# Altium project SNESDRONE_Direct_IO.PrjPcb
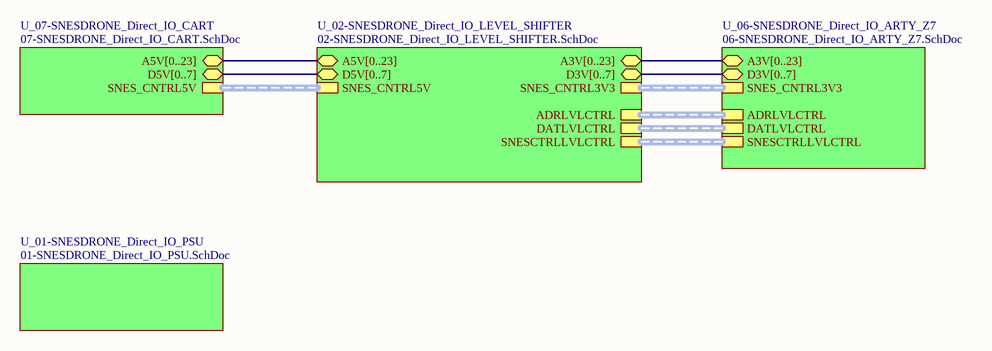
[diagram p0: 00-SNESDRONE_Direct_IO_MAIN.SchDoc]
8 sheets, 28 parts. Net scope: hierarchical (ports join the sheet entries above them; power ports are global).
Board file: SNESDRONE_Direct_IO.PcbDoc
Sheets:
  00-SNESDRONE_Direct_IO_MAIN.SchDoc
    U_01-SNESDRONE_Direct_IO_PSU = 01-SNESDRONE_Direct_IO_PSU.SchDoc
    U_02-SNESDRONE_Direct_IO_LEVEL_SHIFTER = 02-SNESDRONE_Direct_IO_LEVEL_SHIFTER.SchDoc
      U_03-SNESDRONE_Direct_IO_LEVEL_SHIFTER_0 = 03-SNESDRONE_Direct_IO_LEVEL_SHIFTER_0.SchDoc
      U_04-SNESDRONE_Direct_IO_LEVEL_SHIFTER_1 = 04-SNESDRONE_Direct_IO_LEVEL_SHIFTER_1.SchDoc
      U_05-SNESDRONE_Direct_IO_LEVEL_SHIFTER_2 = 05-SNESDRONE_Direct_IO_LEVEL_SHIFTER_2.SchDoc
    U_06-SNESDRONE_Direct_IO_ARTY_Z7 = 06-SNESDRONE_Direct_IO_ARTY_Z7.SchDoc
    U_07-SNESDRONE_Direct_IO_CART = 07-SNESDRONE_Direct_IO_CART.SchDoc

## Sheet 00-SNESDRONE_Direct_IO_MAIN.SchDoc
size A4

### Sub-sheets
U_01-SNESDRONE_Direct_IO_PSU = 01-SNESDRONE_Direct_IO_PSU.SchDoc: no entries
U_02-SNESDRONE_Direct_IO_LEVEL_SHIFTER = 02-SNESDRONE_Direct_IO_LEVEL_SHIFTER.SchDoc: A5V[0..23] (bidir), A3V[0..23] (bidir), D5V[0..7] (bidir), D3V[0..7] (bidir), ADRLVLCTRL (harness ADRLVLCTRL), DATLVLCTRL (harness DATLVLCTRL), SNES_CNTRL5V (harness SNES_CNTRL5V), SNES_CNTRL3V3 (harness SNES_CNTRL3V3), SNESCTRLLVLCTRL (harness SNESCTRLLVLCTRL)
U_06-SNESDRONE_Direct_IO_ARTY_Z7 = 06-SNESDRONE_Direct_IO_ARTY_Z7.SchDoc: A3V[0..23] (bidir), D3V[0..7] (bidir), ADRLVLCTRL (harness ADRLVLCTRL), DATLVLCTRL (harness DATLVLCTRL), SNES_CNTRL3V3 (harness SNES_CNTRL3V3), SNESCTRLLVLCTRL (harness SNESCTRLLVLCTRL)
U_07-SNESDRONE_Direct_IO_CART = 07-SNESDRONE_Direct_IO_CART.SchDoc: A5V[0..23] (bidir), D5V[0..7] (bidir), SNES_CNTRL5V (harness SNES_CNTRL5V)

### Buses and harness runs
bus sheet U_02-SNESDRONE_Direct_IO_LEVEL_SHIFTER/A3V[0..23] = sheet U_06-SNESDRONE_Direct_IO_ARTY_Z7/A3V[0..23]
bus sheet U_02-SNESDRONE_Direct_IO_LEVEL_SHIFTER/A5V[0..23] = sheet U_07-SNESDRONE_Direct_IO_CART/A5V[0..23]
bus sheet U_02-SNESDRONE_Direct_IO_LEVEL_SHIFTER/D3V[0..7] = sheet U_06-SNESDRONE_Direct_IO_ARTY_Z7/D3V[0..7]
bus sheet U_02-SNESDRONE_Direct_IO_LEVEL_SHIFTER/D5V[0..7] = sheet U_07-SNESDRONE_Direct_IO_CART/D5V[0..7]
harness sheet U_02-SNESDRONE_Direct_IO_LEVEL_SHIFTER/ADRLVLCTRL = sheet U_06-SNESDRONE_Direct_IO_ARTY_Z7/ADRLVLCTRL
harness sheet U_02-SNESDRONE_Direct_IO_LEVEL_SHIFTER/DATLVLCTRL = sheet U_06-SNESDRONE_Direct_IO_ARTY_Z7/DATLVLCTRL
harness sheet U_02-SNESDRONE_Direct_IO_LEVEL_SHIFTER/SNES_CNTRL3V3 = sheet U_06-SNESDRONE_Direct_IO_ARTY_Z7/SNES_CNTRL3V3
harness sheet U_02-SNESDRONE_Direct_IO_LEVEL_SHIFTER/SNES_CNTRL5V = sheet U_07-SNESDRONE_Direct_IO_CART/SNES_CNTRL5V
harness sheet U_02-SNESDRONE_Direct_IO_LEVEL_SHIFTER/SNESCTRLLVLCTRL = sheet U_06-SNESDRONE_Direct_IO_ARTY_Z7/SNESCTRLLVLCTRL

## Sheet 01-SNESDRONE_Direct_IO_PSU.SchDoc
size A4
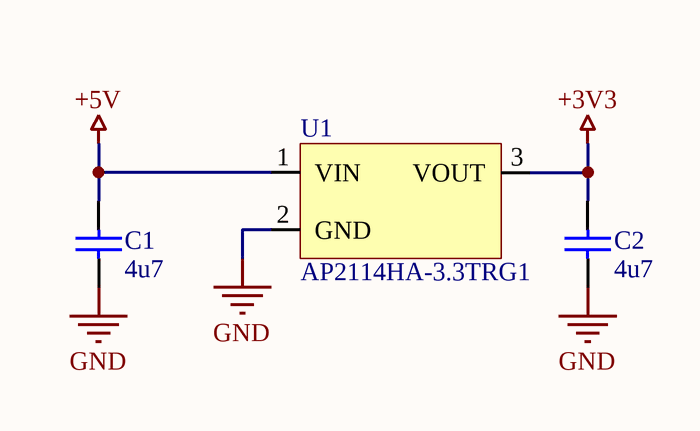
[diagram p1: 01-SNESDRONE_Direct_IO_PSU.SchDoc]

### Parts
C1  value 4u7  [cap_0603]  (hidden comment: cap_0603)
C2  value 4u7  [cap_0603]  (hidden comment: cap_0603)
U1  AP2114HA-3.3TRG1  [SOT223]

### Nets
+3V3: C2.2 U1.3(VOUT)
+5V: C1.2 U1.1(VIN)
GND: C1.1 C2.1 U1.2(GND)

### Library data of the parts
C1 C2 = cap_0603: Capacitor
U1 = AP2114HA-3.3TRG1: PMIC - Spannungsregler - Linear Positiv Fest 1 Ausgang 1A SOT-223-3

## Sheet 02-SNESDRONE_Direct_IO_LEVEL_SHIFTER.SchDoc
size A4
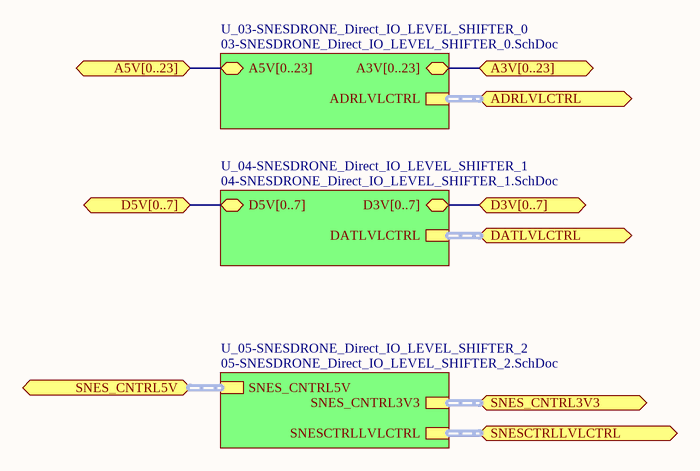
[diagram p2: 02-SNESDRONE_Direct_IO_LEVEL_SHIFTER.SchDoc]

### Sub-sheets
U_03-SNESDRONE_Direct_IO_LEVEL_SHIFTER_0 = 03-SNESDRONE_Direct_IO_LEVEL_SHIFTER_0.SchDoc: A5V[0..23] (bidir), A3V[0..23] (bidir), ADRLVLCTRL (harness ADRLVLCTRL)
U_04-SNESDRONE_Direct_IO_LEVEL_SHIFTER_1 = 04-SNESDRONE_Direct_IO_LEVEL_SHIFTER_1.SchDoc: D5V[0..7] (bidir), D3V[0..7] (bidir), DATLVLCTRL (harness DATLVLCTRL)
U_05-SNESDRONE_Direct_IO_LEVEL_SHIFTER_2 = 05-SNESDRONE_Direct_IO_LEVEL_SHIFTER_2.SchDoc: SNES_CNTRL5V (harness SNES_CNTRL5V), SNES_CNTRL3V3 (harness SNES_CNTRL3V3), SNESCTRLLVLCTRL (harness SNESCTRLLVLCTRL)

### Ports
A3V[0..23] (bidir), A5V[0..23] (bidir), ADRLVLCTRL (bidir, harness ADRLVLCTRL), D3V[0..7] (bidir), D5V[0..7] (bidir), DATLVLCTRL (bidir, harness DATLVLCTRL), SNES_CNTRL3V3 (bidir, harness SNES_CNTRL3V3), SNES_CNTRL5V (bidir, harness SNES_CNTRL5V), SNESCTRLLVLCTRL (bidir, harness SNESCTRLLVLCTRL)

### Buses and harness runs
bus port A3V[0..23] = sheet U_03-SNESDRONE_Direct_IO_LEVEL_SHIFTER_0/A3V[0..23]
bus port A5V[0..23] = sheet U_03-SNESDRONE_Direct_IO_LEVEL_SHIFTER_0/A5V[0..23]
bus port D3V[0..7] = sheet U_04-SNESDRONE_Direct_IO_LEVEL_SHIFTER_1/D3V[0..7]
bus port D5V[0..7] = sheet U_04-SNESDRONE_Direct_IO_LEVEL_SHIFTER_1/D5V[0..7]
harness port ADRLVLCTRL = sheet U_03-SNESDRONE_Direct_IO_LEVEL_SHIFTER_0/ADRLVLCTRL
harness port DATLVLCTRL = sheet U_04-SNESDRONE_Direct_IO_LEVEL_SHIFTER_1/DATLVLCTRL
harness port SNES_CNTRL3V3 = sheet U_05-SNESDRONE_Direct_IO_LEVEL_SHIFTER_2/SNES_CNTRL3V3
harness port SNES_CNTRL5V = sheet U_05-SNESDRONE_Direct_IO_LEVEL_SHIFTER_2/SNES_CNTRL5V
harness port SNESCTRLLVLCTRL = sheet U_05-SNESDRONE_Direct_IO_LEVEL_SHIFTER_2/SNESCTRLLVLCTRL

## Sheet 03-SNESDRONE_Direct_IO_LEVEL_SHIFTER_0.SchDoc
size A4
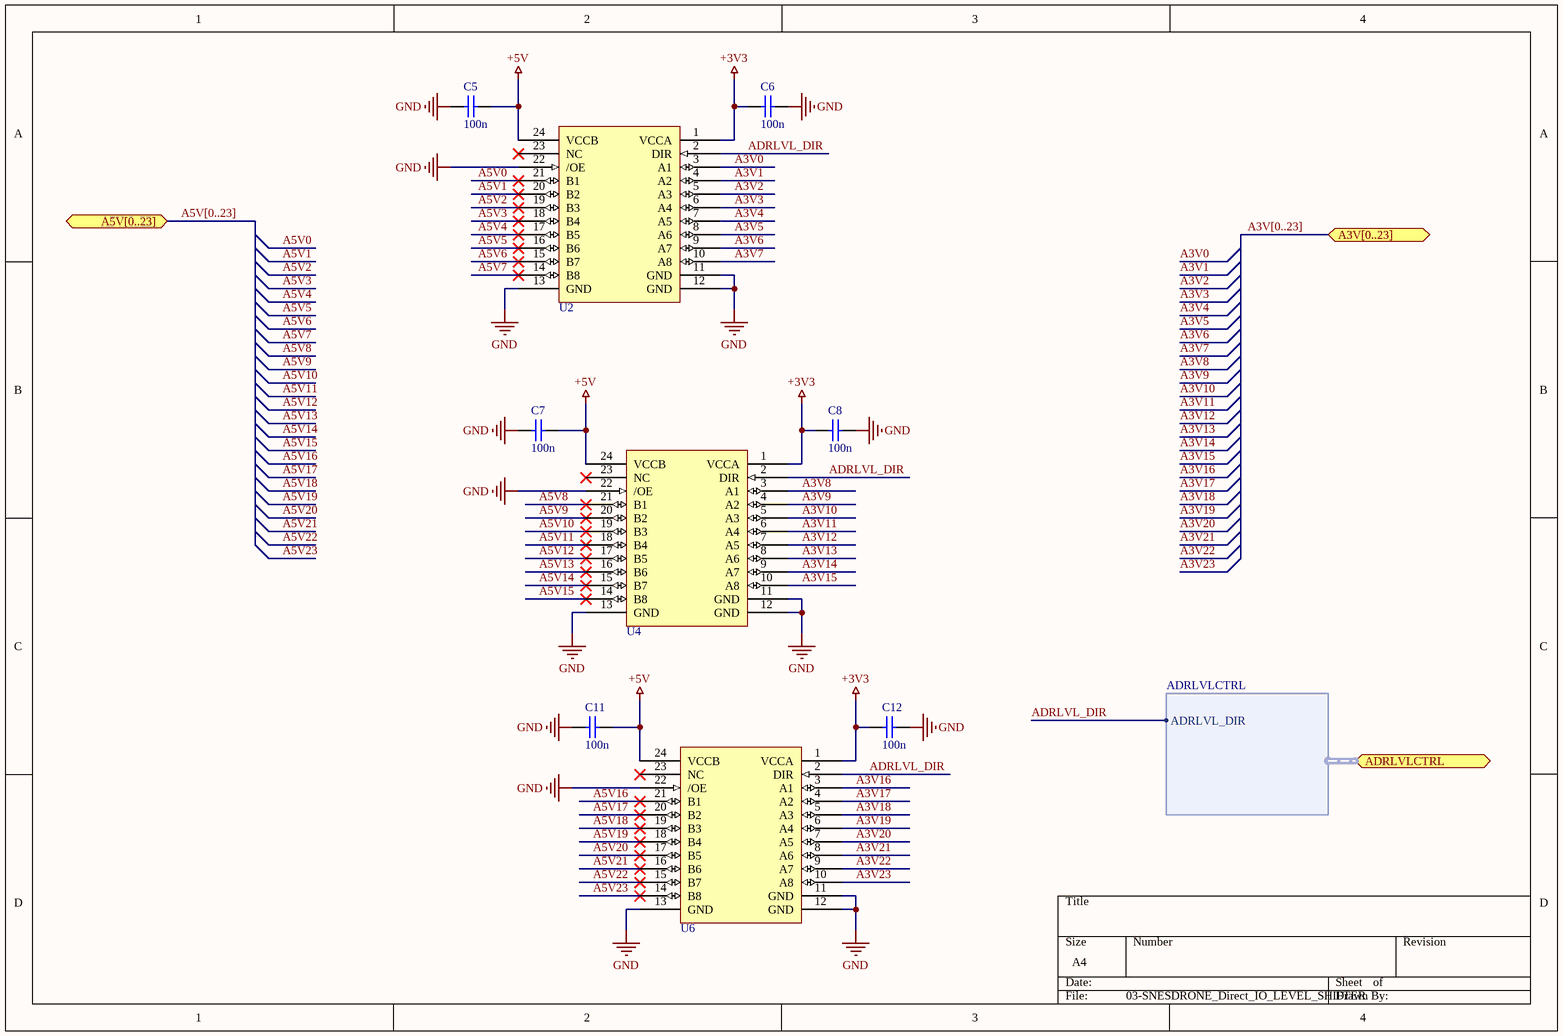
[diagram p3: 03-SNESDRONE_Direct_IO_LEVEL_SHIFTER_0.SchDoc]

### Parts
C5  value 100n  [cap_0603]  (hidden comment: cap_0603)
C6  value 100n  [cap_0603]  (hidden comment: cap_0603)
C7  value 100n  [cap_0603]  (hidden comment: cap_0603)
C8  value 100n  [cap_0603]  (hidden comment: cap_0603)
C11  value 100n  [cap_0603]  (hidden comment: cap_0603)
C12  value 100n  [cap_0603]  (hidden comment: cap_0603)
U2  IC_SN74LVCC3245APWR  [TSSOP24]  (value not drawn)
U4  IC_SN74LVCC3245APWR  [TSSOP24]  (value not drawn)
U6  IC_SN74LVCC3245APWR  [TSSOP24]  (value not drawn)

### Ports
A3V[0..23] (bidir), A5V[0..23] (bidir), ADRLVLCTRL (bidir, harness ADRLVLCTRL)

### Harnesses
ADRLVLCTRL: ADRLVL_DIR

### Nets
+3V3: C6.2 C8.2 C12.2 U2.1(VCCA) U4.1(VCCA) U6.1(VCCA)
+5V: C5.1 C7.1 C11.1 U2.24(VCCB) U4.24(VCCB) U6.24(VCCB)
GND: C5.2 C6.1 C7.2 C8.1 C11.2 C12.1 U2.11(GND) U2.12(GND) U2.13(GND) U2.22(/OE) U4.11(GND) U4.12(GND) U4.13(GND) U4.22(/OE) U6.11(GND) U6.12(GND) U6.13(GND) U6.22(/OE)
A3V0: U2.3(A1)
A3V1: U2.4(A2)
A3V2: U2.5(A3)
A3V3: U2.6(A4)
A3V4: U2.7(A5)
A3V5: U2.8(A6)
A3V6: U2.9(A7)
A3V7: U2.10(A8)
A3V8: U4.3(A1)
A3V9: U4.4(A2)
A3V10: U4.5(A3)
A3V11: U4.6(A4)
A3V12: U4.7(A5)
A3V13: U4.8(A6)
A3V14: U4.9(A7)
A3V15: U4.10(A8)
A3V16: U6.3(A1)
A3V17: U6.4(A2)
A3V18: U6.5(A3)
A3V19: U6.6(A4)
A3V20: U6.7(A5)
A3V21: U6.8(A6)
A3V22: U6.9(A7)
A3V23: U6.10(A8)
A5V0: U2.21(B1)
A5V1: U2.20(B2)
A5V2: U2.19(B3)
A5V3: U2.18(B4)
A5V4: U2.17(B5)
A5V5: U2.16(B6)
A5V6: U2.15(B7)
A5V7: U2.14(B8)
A5V8: U4.21(B1)
A5V9: U4.20(B2)
A5V10: U4.19(B3)
A5V11: U4.18(B4)
A5V12: U4.17(B5)
A5V13: U4.16(B6)
A5V14: U4.15(B7)
A5V15: U4.14(B8)
A5V16: U6.21(B1)
A5V17: U6.20(B2)
A5V18: U6.19(B3)
A5V19: U6.18(B4)
A5V20: U6.17(B5)
A5V21: U6.16(B6)
A5V22: U6.15(B7)
A5V23: U6.14(B8)
ADRLVL_DIR: U2.2(DIR) U4.2(DIR) U6.2(DIR) ; port ADRLVLCTRL.ADRLVL_DIR

Not connected (* = marked no-connect by the designer): U2 23(NC)*; U4 23(NC)*; U6 23(NC)*

### Buses and harness runs
bus A3V[0..23] = port A3V[0..23]
bus A5V[0..23] = port A5V[0..23]

### Library data of the parts
C5-C8 C11 C12 = cap_0603: Capacitor
U2 U4 U6 = IC_SN74LVCC3245APWR: Bus-Transceiver, Produktreihe LVC, 8 Eingänge, 50mA, 7ns, 2.3V bis 5.5V, TSSOP 24; Manufacturer 1: TEXAS INSTRUMENTS; ComponentLink3Description: datsheet; ComponentLink3URL: http://www.ti.com/lit/ds/symlink/sn74lvcc3245a.pdf; ComponentLink4Description: farnell; ComponentLink4URL: https://at.farnell.com/texas-instruments/sn74lvcc3245apwr/bus-transceiver-8bit-tssop-24/dp/2854646?rpsku=rel3%3A2119962&st=2119962; Supplier 1: Farnell; Supplier Part Number 1: 2854646; Manufacturer Part Number 1: SN74LVCC3245APWR; Supplier Unit Price 1: 0,99; Supplier Order Qty 1: 1

## Sheet 04-SNESDRONE_Direct_IO_LEVEL_SHIFTER_1.SchDoc
size A4
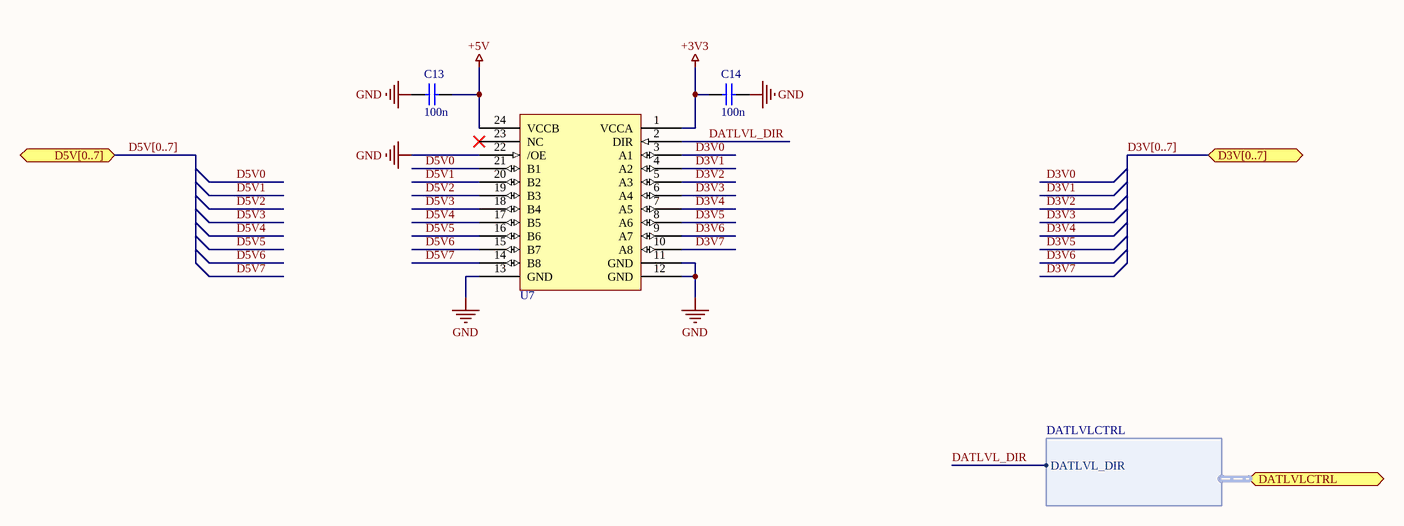
[diagram p4: 04-SNESDRONE_Direct_IO_LEVEL_SHIFTER_1.SchDoc]

### Parts
C13  value 100n  [cap_0603]  (hidden comment: cap_0603)
C14  value 100n  [cap_0603]  (hidden comment: cap_0603)
U7  IC_SN74LVCC3245APWR  [TSSOP24]  (value not drawn)

### Ports
D3V[0..7] (bidir), D5V[0..7] (bidir), DATLVLCTRL (bidir, harness DATLVLCTRL)

### Harnesses
DATLVLCTRL: DATLVL_DIR

### Nets
+3V3: C14.2 U7.1(VCCA)
+5V: C13.1 U7.24(VCCB)
GND: C13.2 C14.1 U7.11(GND) U7.12(GND) U7.13(GND) U7.22(/OE)
D3V0: U7.3(A1)
D3V1: U7.4(A2)
D3V2: U7.5(A3)
D3V3: U7.6(A4)
D3V4: U7.7(A5)
D3V5: U7.8(A6)
D3V6: U7.9(A7)
D3V7: U7.10(A8)
D5V0: U7.21(B1)
D5V1: U7.20(B2)
D5V2: U7.19(B3)
D5V3: U7.18(B4)
D5V4: U7.17(B5)
D5V5: U7.16(B6)
D5V6: U7.15(B7)
D5V7: U7.14(B8)
DATLVL_DIR: U7.2(DIR) ; port DATLVLCTRL.DATLVL_DIR

Not connected (* = marked no-connect by the designer): U7 23(NC)*

### Buses and harness runs
bus D3V[0..7] = port D3V[0..7]
bus D5V[0..7] = port D5V[0..7]

### Library data of the parts
C13 C14 = cap_0603: Capacitor
U7 = IC_SN74LVCC3245APWR: as U2 on sheet 03-SNESDRONE_Direct_IO_LEVEL_SHIFTER_0; ComponentLink3Description: datsheet; ComponentLink3URL: http://www.ti.com/lit/ds/symlink/sn74lvcc3245a.pdf; ComponentLink4Description: farnell; ComponentLink4URL: https://at.farnell.com/texas-instruments/sn74lvcc3245apwr/bus-transceiver-8bit-tssop-24/dp/2854646?rpsku=rel3%3A2119962&st=2119962; Supplier 1: Farnell; Supplier Part Number 1: 2854646; Manufacturer Part Number 1: SN74LVCC3245APWR; Supplier Unit Price 1: 0,99; Supplier Order Qty 1: 1

## Sheet 05-SNESDRONE_Direct_IO_LEVEL_SHIFTER_2.SchDoc
size A4
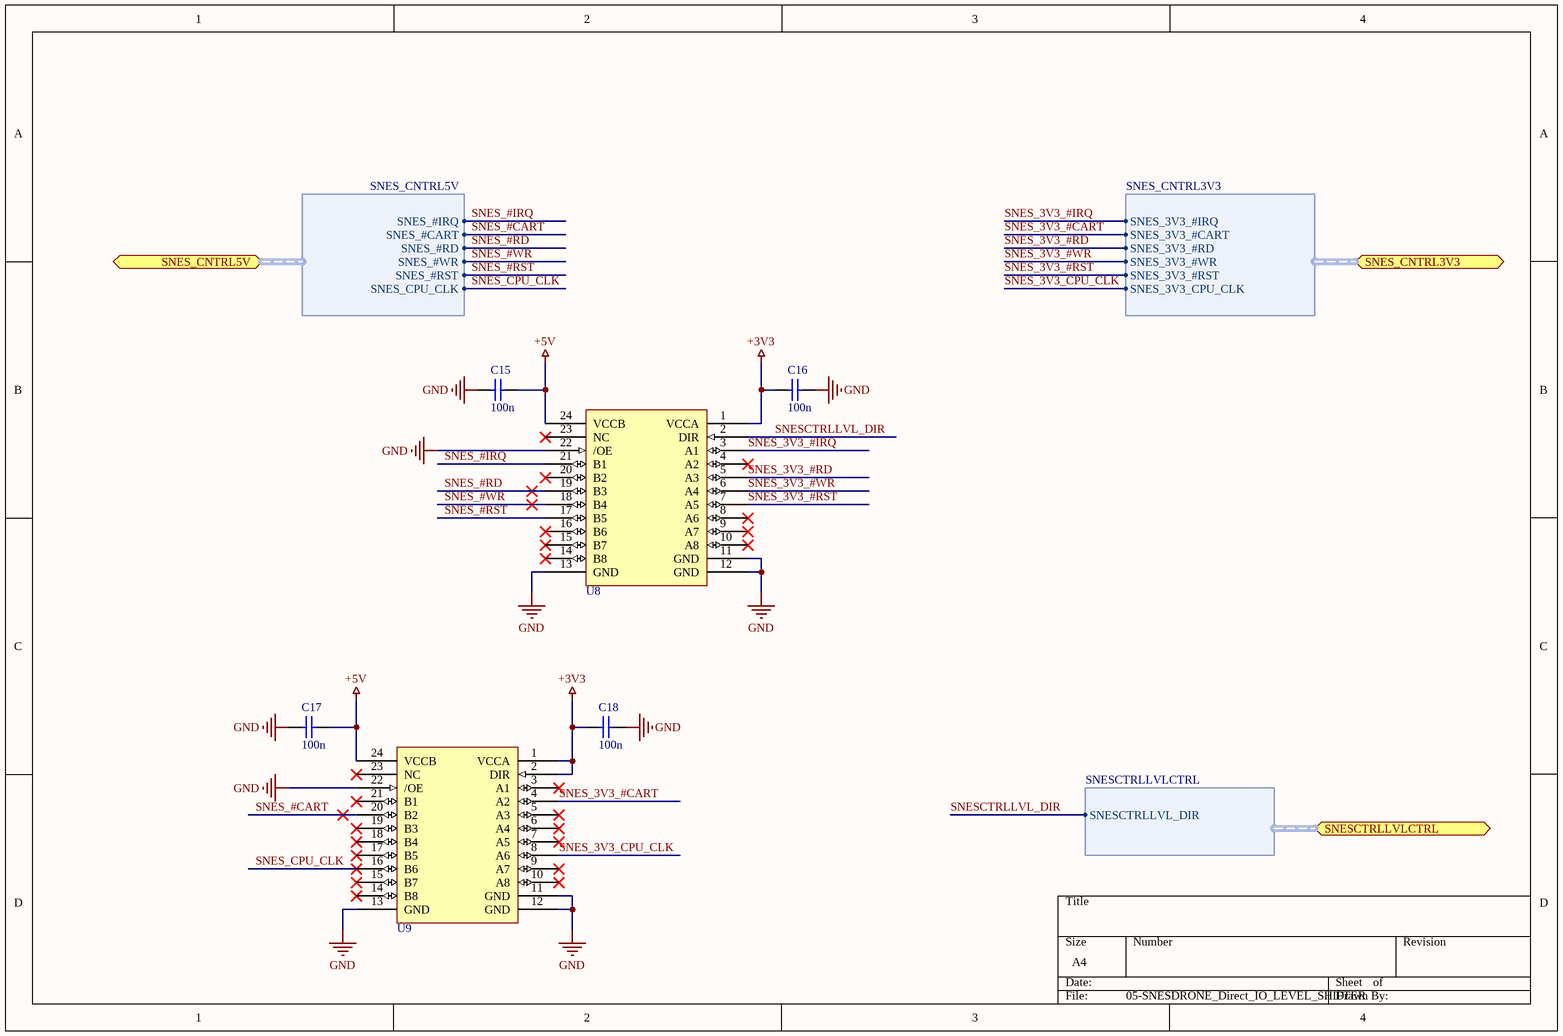
[diagram p5: 05-SNESDRONE_Direct_IO_LEVEL_SHIFTER_2.SchDoc]

### Parts
C15  value 100n  [cap_0603]  (hidden comment: cap_0603)
C16  value 100n  [cap_0603]  (hidden comment: cap_0603)
C17  value 100n  [cap_0603]  (hidden comment: cap_0603)
C18  value 100n  [cap_0603]  (hidden comment: cap_0603)
U8  IC_SN74LVCC3245APWR  [TSSOP24]  (value not drawn)
U9  IC_SN74LVCC3245APWR  [TSSOP24]  (value not drawn)

### Ports
SNES_CNTRL3V3 (bidir, harness SNES_CNTRL3V3), SNES_CNTRL5V (bidir, harness SNES_CNTRL5V), SNESCTRLLVLCTRL (bidir, harness SNESCTRLLVLCTRL)

### Harnesses
SNES_CNTRL5V: SNES_#IRQ, SNES_#CART, SNES_#RD, SNES_#WR, SNES_#RST, SNES_CPU_CLK
SNES_CNTRL3V3: SNES_3V3_#IRQ, SNES_3V3_#CART, SNES_3V3_#RD, SNES_3V3_#WR, SNES_3V3_#RST, SNES_3V3_CPU_CLK
SNESCTRLLVLCTRL: SNESCTRLLVL_DIR

### Nets
+3V3: C16.2 C18.2 U8.1(VCCA) U9.1(VCCA) U9.2(DIR)
+5V: C15.1 C17.1 U8.24(VCCB) U9.24(VCCB)
GND: C15.2 C16.1 C17.2 C18.1 U8.11(GND) U8.12(GND) U8.13(GND) U8.22(/OE) U9.11(GND) U9.12(GND) U9.13(GND) U9.22(/OE)
SNES_3V3_#CART: U9.4(A2) ; port SNES_CNTRL3V3.SNES_3V3_#CART
SNES_3V3_#IRQ: U8.3(A1) ; port SNES_CNTRL3V3.SNES_3V3_#IRQ
SNES_3V3_#RD: U8.5(A3) ; port SNES_CNTRL3V3.SNES_3V3_#RD
SNES_3V3_#RST: U8.7(A5) ; port SNES_CNTRL3V3.SNES_3V3_#RST
SNES_3V3_#WR: U8.6(A4) ; port SNES_CNTRL3V3.SNES_3V3_#WR
SNES_3V3_CPU_CLK: U9.8(A6) ; port SNES_CNTRL3V3.SNES_3V3_CPU_CLK
SNES_#CART: U9.20(B2) ; port SNES_CNTRL5V.SNES_#CART
SNES_#IRQ: U8.21(B1) ; port SNES_CNTRL5V.SNES_#IRQ
SNES_#RD: U8.19(B3) ; port SNES_CNTRL5V.SNES_#RD
SNES_#RST: U8.17(B5) ; port SNES_CNTRL5V.SNES_#RST
SNES_#WR: U8.18(B4) ; port SNES_CNTRL5V.SNES_#WR
SNES_CPU_CLK: U9.16(B6) ; port SNES_CNTRL5V.SNES_CPU_CLK
SNESCTRLLVL_DIR: U8.2(DIR) ; port SNESCTRLLVLCTRL.SNESCTRLLVL_DIR

Not connected (* = marked no-connect by the designer): U8 4(A2)* 8(A6)* 9(A7)* 10(A8)* 14(B8)* 15(B7)* 16(B6)* 20(B2)* 23(NC)*; U9 3(A1)* 5(A3)* 6(A4)* 7(A5)* 9(A7)* 10(A8)* 14(B8)* 15(B7)* 17(B5)* 18(B4)* 19(B3)* 21(B1)* 23(NC)*

### Library data of the parts
C15-C18 = cap_0603: Capacitor
U8 U9 = IC_SN74LVCC3245APWR: as U2 on sheet 03-SNESDRONE_Direct_IO_LEVEL_SHIFTER_0; ComponentLink3Description: datsheet; ComponentLink3URL: http://www.ti.com/lit/ds/symlink/sn74lvcc3245a.pdf; ComponentLink4Description: farnell; ComponentLink4URL: https://at.farnell.com/texas-instruments/sn74lvcc3245apwr/bus-transceiver-8bit-tssop-24/dp/2854646?rpsku=rel3%3A2119962&st=2119962; Supplier 1: Farnell; Supplier Part Number 1: 2854646; Manufacturer Part Number 1: SN74LVCC3245APWR; Supplier Unit Price 1: 0,99; Supplier Order Qty 1: 1

## Sheet 06-SNESDRONE_Direct_IO_ARTY_Z7.SchDoc
size A
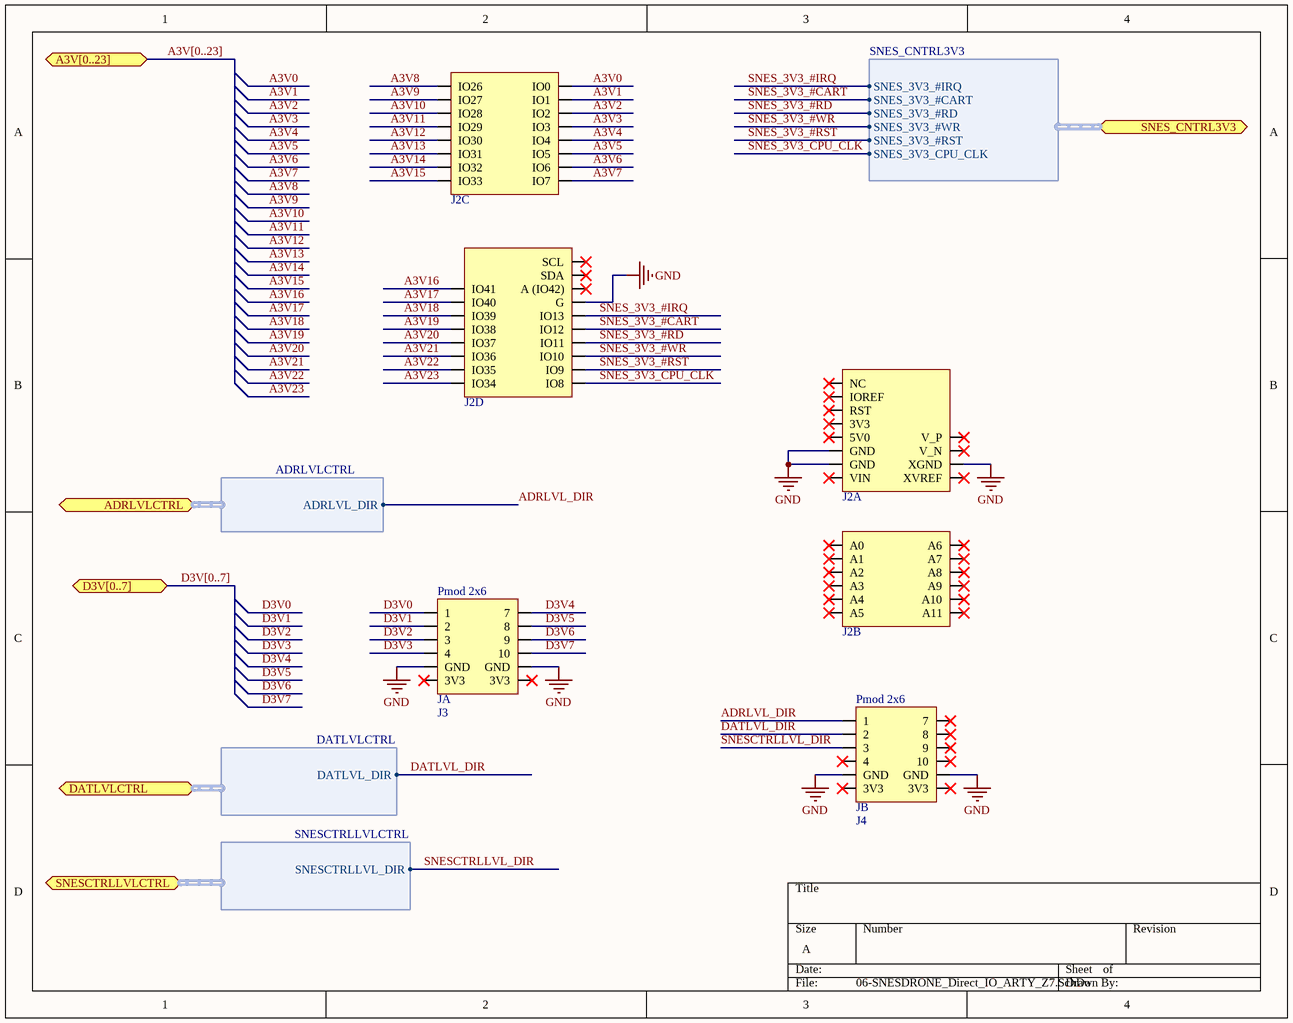
[diagram p6: 06-SNESDRONE_Direct_IO_ARTY_Z7.SchDoc]

### Parts
J2  ARTY_Z7  [arty-z7]  (value not drawn)  (parts A,B,C,D of 4)  (no BOM)
J3  ARTY_Z7_PMOD_A  [arty-z7-pmod]  (value not drawn)  (no BOM)
J4  ARTY_Z7_PMOD_B  [arty-z7-pmod]  (value not drawn)  (no BOM)

### Ports
A3V[0..23] (bidir), ADRLVLCTRL (bidir, harness ADRLVLCTRL), D3V[0..7] (bidir), DATLVLCTRL (bidir, harness DATLVLCTRL), SNES_CNTRL3V3 (bidir, harness SNES_CNTRL3V3), SNESCTRLLVLCTRL (bidir, harness SNESCTRLLVLCTRL)

### Harnesses
DATLVLCTRL: DATLVL_DIR
SNES_CNTRL3V3: SNES_3V3_#IRQ, SNES_3V3_#CART, SNES_3V3_#RD, SNES_3V3_#WR, SNES_3V3_#RST, SNES_3V3_CPU_CLK
SNESCTRLLVLCTRL: SNESCTRLLVL_DIR
ADRLVLCTRL: ADRLVL_DIR

### Nets
GND: J2.5(GND) J2.6(GND) J2.9(XGND) J2.54(G) J3.4(GND) J3.7(GND) J4.4(GND) J4.7(GND)
A3V0: J2.32(IO0)
A3V1: J2.33(IO1)
A3V2: J2.34(IO2)
A3V3: J2.35(IO3)
A3V4: J2.36(IO4)
A3V5: J2.37(IO5)
A3V6: J2.38(IO6)
A3V7: J2.39(IO7)
A3V8: J2.31(IO26)
A3V9: J2.30(IO27)
A3V10: J2.29(IO28)
A3V11: J2.28(IO29)
A3V12: J2.27(IO30)
A3V13: J2.26(IO31)
A3V14: J2.25(IO32)
A3V15: J2.24(IO33)
A3V16: J2.40(IO41)
A3V17: J2.41(IO40)
A3V18: J2.42(IO39)
A3V19: J2.43(IO38)
A3V20: J2.44(IO37)
A3V21: J2.45(IO36)
A3V22: J2.46(IO35)
A3V23: J2.47(IO34)
ADRLVL_DIR: J4.0(1) ; port ADRLVLCTRL.ADRLVL_DIR
D3V0: J3.0(1)
D3V1: J3.1(2)
D3V2: J3.2(3)
D3V3: J3.3(4)
D3V4: J3.11(7)
D3V5: J3.10(8)
D3V6: J3.9
D3V7: J3.8(10)
DATLVL_DIR: J4.1(2) ; port DATLVLCTRL.DATLVL_DIR
SNES_3V3_#CART: J2.52(IO12) ; port SNES_CNTRL3V3.SNES_3V3_#CART
SNES_3V3_#IRQ: J2.53(IO13) ; port SNES_CNTRL3V3.SNES_3V3_#IRQ
SNES_3V3_#RD: J2.51(IO11) ; port SNES_CNTRL3V3.SNES_3V3_#RD
SNES_3V3_#RST: J2.49(IO9) ; port SNES_CNTRL3V3.SNES_3V3_#RST
SNES_3V3_#WR: J2.50(IO10) ; port SNES_CNTRL3V3.SNES_3V3_#WR
SNES_3V3_CPU_CLK: J2.48(IO8) ; port SNES_CNTRL3V3.SNES_3V3_CPU_CLK
SNESCTRLLVL_DIR: J4.2(3) ; port SNESCTRLLVLCTRL.SNESCTRLLVL_DIR

Not connected (* = marked no-connect by the designer): J2 0(NC)* 1(IOREF)* 2(RST)* 3(3V3)* 4(5V0)* 7(VIN)* 8(XVREF)* 10(V_N)* 11(V_P)* 12(A0)* 13(A1)* 14(A2)* 15(A3)* 16(A4)* 17(A5)* 18(A11)* 19(A10)* 20(A9)* 21(A8)* 22(A7)* 23(A6)* 55(A_(IO42))* 56(SDA)* 57(SCL)*; J3 5(3V3)* 6(3V3)*; J4 3(4)* 5(3V3)* 6(3V3)* 8(10)* 9* 10(8)* 11(7)*

### Buses and harness runs
bus A3V[0..23] = port A3V[0..23]
bus D3V[0..7] = port D3V[0..7]

### Notes on the sheet
- (in symbol ARTY_Z7_PMOD_A) Pmod 2x6; JA
- (in symbol ARTY_Z7_PMOD_B) Pmod 2x6; JB

### Library data of the parts
J2 = ARTY_Z7: Connections to Arty Z7 SoC Board
J3 = ARTY_Z7_PMOD_A: Connections to Arty Z7 SoC Board
J4 = ARTY_Z7_PMOD_B: Connections to Arty Z7 SoC Board

## Sheet 07-SNESDRONE_Direct_IO_CART.SchDoc
size A4
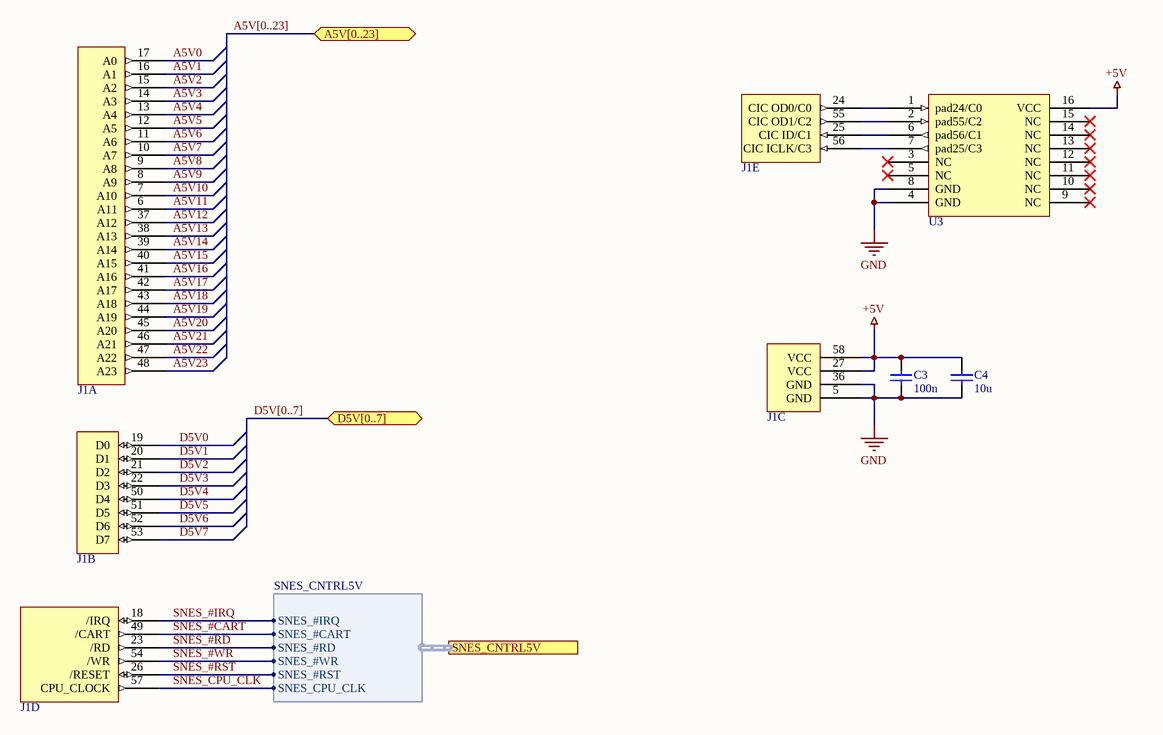
[diagram p7: 07-SNESDRONE_Direct_IO_CART.SchDoc]

### Parts
C3  value 100n  [cap_0603]  (hidden comment: cap_0603)
C4  value 10u  [cap_0603]  (hidden comment: cap_0603)
J1  SNES Cartridge Connector  [SNES Cartridge Connector]  (value not drawn)  (parts A,B,C,D,E of 5)  (net tie, no BOM)
U3  IC_D411A  [DIP16]  (value not drawn)  (net tie, no BOM)

### Ports
A5V[0..23] (bidir), D5V[0..7] (bidir), SNES_CNTRL5V (harness SNES_CNTRL5V)

### Harnesses
SNES_CNTRL5V: SNES_#IRQ, SNES_#CART, SNES_#RD, SNES_#WR, SNES_#RST, SNES_CPU_CLK

### Nets
+5V: C3.2 C4.2 J1.27(VCC) J1.58(VCC) U3.16(VCC)
GND: C3.1 C4.1 J1.5(GND) J1.36(GND) U3.4(GND) U3.8(GND)
A5V0: J1.17(A0)
A5V1: J1.16(A1)
A5V2: J1.15(A2)
A5V3: J1.14(A3)
A5V4: J1.13(A4)
A5V5: J1.12(A5)
A5V6: J1.11(A6)
A5V7: J1.10(A7)
A5V8: J1.9(A8)
A5V9: J1.8(A9)
A5V10: J1.7(A10)
A5V11: J1.6(A11)
A5V12: J1.37(A12)
A5V13: J1.38(A13)
A5V14: J1.39(A14)
A5V15: J1.40(A15)
A5V16: J1.41(A16)
A5V17: J1.42(A17)
A5V18: J1.43(A18)
A5V19: J1.44(A19)
A5V20: J1.45(A20)
A5V21: J1.46(A21)
A5V22: J1.47(A22)
A5V23: J1.48(A23)
D5V0: J1.19(D0)
D5V1: J1.20(D1)
D5V2: J1.21(D2)
D5V3: J1.22(D3)
D5V4: J1.50(D4)
D5V5: J1.51(D5)
D5V6: J1.52(D6)
D5V7: J1.53(D7)
SNES_#CART: J1.49(/CART) ; port SNES_CNTRL5V.SNES_#CART
SNES_#IRQ: J1.18(/IRQ) ; port SNES_CNTRL5V.SNES_#IRQ
SNES_#RD: J1.23(/RD) ; port SNES_CNTRL5V.SNES_#RD
SNES_#RST: J1.26(/RESET) ; port SNES_CNTRL5V.SNES_#RST
SNES_#WR: J1.54(/WR) ; port SNES_CNTRL5V.SNES_#WR
SNES_CPU_CLK: J1.57(CPU_CLOCK) ; port SNES_CNTRL5V.SNES_CPU_CLK
NetJ1_24: J1.24(CIC_OD0/C0) U3.1(pad24/C0)
NetJ1_25: J1.25(CIC_ID/C1) U3.6(pad56/C1)
NetJ1_55: J1.55(CIC_OD1/C2) U3.2(pad55/C2)
NetJ1_56: J1.56(CIC_ICLK/C3) U3.7(pad25/C3)

Not connected (* = marked no-connect by the designer): U3 3(NC)* 5(NC)* 9(NC)* 10(NC)* 11(NC)* 12(NC)* 13(NC)* 14(NC)* 15(NC)*

### Buses and harness runs
bus A5V[0..23] = port A5V[0..23]
bus D5V[0..7] = port D5V[0..7]

### Library data of the parts
C3 C4 = cap_0603: Capacitor
U3 = IC_D411A: SNES CIC Chip; ComponentLink1Description: info; ComponentLink1URL: https://wiki.superfamicom.org/cic

## Nets that join several sheets
+3V3: 01-SNESDRONE_Direct_IO_PSU (C2.2 U1.3), 03-SNESDRONE_Direct_IO_LEVEL_SHIFTER_0 (6 pins), 04-SNESDRONE_Direct_IO_LEVEL_SHIFTER_1 (C14.2 U7.1), 05-SNESDRONE_Direct_IO_LEVEL_SHIFTER_2 (5 pins)
+5V: 01-SNESDRONE_Direct_IO_PSU (C1.2 U1.1), 03-SNESDRONE_Direct_IO_LEVEL_SHIFTER_0 (6 pins), 04-SNESDRONE_Direct_IO_LEVEL_SHIFTER_1 (C13.1 U7.24), 05-SNESDRONE_Direct_IO_LEVEL_SHIFTER_2 (C15.1 C17.1 U8.24 U9.24), 07-SNESDRONE_Direct_IO_CART (5 pins)
GND: 01-SNESDRONE_Direct_IO_PSU (C1.1 C2.1 U1.2), 03-SNESDRONE_Direct_IO_LEVEL_SHIFTER_0 (18 pins), 04-SNESDRONE_Direct_IO_LEVEL_SHIFTER_1 (6 pins), 05-SNESDRONE_Direct_IO_LEVEL_SHIFTER_2 (12 pins), 06-SNESDRONE_Direct_IO_ARTY_Z7 (8 pins), 07-SNESDRONE_Direct_IO_CART (6 pins)
A3V0: 03-SNESDRONE_Direct_IO_LEVEL_SHIFTER_0 (U2.3), 06-SNESDRONE_Direct_IO_ARTY_Z7 (J2.32)
A3V1: 03-SNESDRONE_Direct_IO_LEVEL_SHIFTER_0 (U2.4), 06-SNESDRONE_Direct_IO_ARTY_Z7 (J2.33)
A3V2: 03-SNESDRONE_Direct_IO_LEVEL_SHIFTER_0 (U2.5), 06-SNESDRONE_Direct_IO_ARTY_Z7 (J2.34)
A3V3: 03-SNESDRONE_Direct_IO_LEVEL_SHIFTER_0 (U2.6), 06-SNESDRONE_Direct_IO_ARTY_Z7 (J2.35)
A3V4: 03-SNESDRONE_Direct_IO_LEVEL_SHIFTER_0 (U2.7), 06-SNESDRONE_Direct_IO_ARTY_Z7 (J2.36)
A3V5: 03-SNESDRONE_Direct_IO_LEVEL_SHIFTER_0 (U2.8), 06-SNESDRONE_Direct_IO_ARTY_Z7 (J2.37)
A3V6: 03-SNESDRONE_Direct_IO_LEVEL_SHIFTER_0 (U2.9), 06-SNESDRONE_Direct_IO_ARTY_Z7 (J2.38)
A3V7: 03-SNESDRONE_Direct_IO_LEVEL_SHIFTER_0 (U2.10), 06-SNESDRONE_Direct_IO_ARTY_Z7 (J2.39)
A3V8: 03-SNESDRONE_Direct_IO_LEVEL_SHIFTER_0 (U4.3), 06-SNESDRONE_Direct_IO_ARTY_Z7 (J2.31)
A3V9: 03-SNESDRONE_Direct_IO_LEVEL_SHIFTER_0 (U4.4), 06-SNESDRONE_Direct_IO_ARTY_Z7 (J2.30)
A3V10: 03-SNESDRONE_Direct_IO_LEVEL_SHIFTER_0 (U4.5), 06-SNESDRONE_Direct_IO_ARTY_Z7 (J2.29)
A3V11: 03-SNESDRONE_Direct_IO_LEVEL_SHIFTER_0 (U4.6), 06-SNESDRONE_Direct_IO_ARTY_Z7 (J2.28)
A3V12: 03-SNESDRONE_Direct_IO_LEVEL_SHIFTER_0 (U4.7), 06-SNESDRONE_Direct_IO_ARTY_Z7 (J2.27)
A3V13: 03-SNESDRONE_Direct_IO_LEVEL_SHIFTER_0 (U4.8), 06-SNESDRONE_Direct_IO_ARTY_Z7 (J2.26)
A3V14: 03-SNESDRONE_Direct_IO_LEVEL_SHIFTER_0 (U4.9), 06-SNESDRONE_Direct_IO_ARTY_Z7 (J2.25)
A3V15: 03-SNESDRONE_Direct_IO_LEVEL_SHIFTER_0 (U4.10), 06-SNESDRONE_Direct_IO_ARTY_Z7 (J2.24)
A3V16: 03-SNESDRONE_Direct_IO_LEVEL_SHIFTER_0 (U6.3), 06-SNESDRONE_Direct_IO_ARTY_Z7 (J2.40)
A3V17: 03-SNESDRONE_Direct_IO_LEVEL_SHIFTER_0 (U6.4), 06-SNESDRONE_Direct_IO_ARTY_Z7 (J2.41)
A3V18: 03-SNESDRONE_Direct_IO_LEVEL_SHIFTER_0 (U6.5), 06-SNESDRONE_Direct_IO_ARTY_Z7 (J2.42)
A3V19: 03-SNESDRONE_Direct_IO_LEVEL_SHIFTER_0 (U6.6), 06-SNESDRONE_Direct_IO_ARTY_Z7 (J2.43)
A3V20: 03-SNESDRONE_Direct_IO_LEVEL_SHIFTER_0 (U6.7), 06-SNESDRONE_Direct_IO_ARTY_Z7 (J2.44)
A3V21: 03-SNESDRONE_Direct_IO_LEVEL_SHIFTER_0 (U6.8), 06-SNESDRONE_Direct_IO_ARTY_Z7 (J2.45)
A3V22: 03-SNESDRONE_Direct_IO_LEVEL_SHIFTER_0 (U6.9), 06-SNESDRONE_Direct_IO_ARTY_Z7 (J2.46)
A3V23: 03-SNESDRONE_Direct_IO_LEVEL_SHIFTER_0 (U6.10), 06-SNESDRONE_Direct_IO_ARTY_Z7 (J2.47)
A5V0: 03-SNESDRONE_Direct_IO_LEVEL_SHIFTER_0 (U2.21), 07-SNESDRONE_Direct_IO_CART (J1.17)
A5V1: 03-SNESDRONE_Direct_IO_LEVEL_SHIFTER_0 (U2.20), 07-SNESDRONE_Direct_IO_CART (J1.16)
A5V2: 03-SNESDRONE_Direct_IO_LEVEL_SHIFTER_0 (U2.19), 07-SNESDRONE_Direct_IO_CART (J1.15)
A5V3: 03-SNESDRONE_Direct_IO_LEVEL_SHIFTER_0 (U2.18), 07-SNESDRONE_Direct_IO_CART (J1.14)
A5V4: 03-SNESDRONE_Direct_IO_LEVEL_SHIFTER_0 (U2.17), 07-SNESDRONE_Direct_IO_CART (J1.13)
A5V5: 03-SNESDRONE_Direct_IO_LEVEL_SHIFTER_0 (U2.16), 07-SNESDRONE_Direct_IO_CART (J1.12)
A5V6: 03-SNESDRONE_Direct_IO_LEVEL_SHIFTER_0 (U2.15), 07-SNESDRONE_Direct_IO_CART (J1.11)
A5V7: 03-SNESDRONE_Direct_IO_LEVEL_SHIFTER_0 (U2.14), 07-SNESDRONE_Direct_IO_CART (J1.10)
A5V8: 03-SNESDRONE_Direct_IO_LEVEL_SHIFTER_0 (U4.21), 07-SNESDRONE_Direct_IO_CART (J1.9)
A5V9: 03-SNESDRONE_Direct_IO_LEVEL_SHIFTER_0 (U4.20), 07-SNESDRONE_Direct_IO_CART (J1.8)
A5V10: 03-SNESDRONE_Direct_IO_LEVEL_SHIFTER_0 (U4.19), 07-SNESDRONE_Direct_IO_CART (J1.7)
A5V11: 03-SNESDRONE_Direct_IO_LEVEL_SHIFTER_0 (U4.18), 07-SNESDRONE_Direct_IO_CART (J1.6)
A5V12: 03-SNESDRONE_Direct_IO_LEVEL_SHIFTER_0 (U4.17), 07-SNESDRONE_Direct_IO_CART (J1.37)
A5V13: 03-SNESDRONE_Direct_IO_LEVEL_SHIFTER_0 (U4.16), 07-SNESDRONE_Direct_IO_CART (J1.38)
A5V14: 03-SNESDRONE_Direct_IO_LEVEL_SHIFTER_0 (U4.15), 07-SNESDRONE_Direct_IO_CART (J1.39)
A5V15: 03-SNESDRONE_Direct_IO_LEVEL_SHIFTER_0 (U4.14), 07-SNESDRONE_Direct_IO_CART (J1.40)
A5V16: 03-SNESDRONE_Direct_IO_LEVEL_SHIFTER_0 (U6.21), 07-SNESDRONE_Direct_IO_CART (J1.41)
A5V17: 03-SNESDRONE_Direct_IO_LEVEL_SHIFTER_0 (U6.20), 07-SNESDRONE_Direct_IO_CART (J1.42)
A5V18: 03-SNESDRONE_Direct_IO_LEVEL_SHIFTER_0 (U6.19), 07-SNESDRONE_Direct_IO_CART (J1.43)
A5V19: 03-SNESDRONE_Direct_IO_LEVEL_SHIFTER_0 (U6.18), 07-SNESDRONE_Direct_IO_CART (J1.44)
A5V20: 03-SNESDRONE_Direct_IO_LEVEL_SHIFTER_0 (U6.17), 07-SNESDRONE_Direct_IO_CART (J1.45)
A5V21: 03-SNESDRONE_Direct_IO_LEVEL_SHIFTER_0 (U6.16), 07-SNESDRONE_Direct_IO_CART (J1.46)
A5V22: 03-SNESDRONE_Direct_IO_LEVEL_SHIFTER_0 (U6.15), 07-SNESDRONE_Direct_IO_CART (J1.47)
A5V23: 03-SNESDRONE_Direct_IO_LEVEL_SHIFTER_0 (U6.14), 07-SNESDRONE_Direct_IO_CART (J1.48)
ADRLVL_DIR: 03-SNESDRONE_Direct_IO_LEVEL_SHIFTER_0 (U2.2 U4.2 U6.2), 06-SNESDRONE_Direct_IO_ARTY_Z7 (J4.0)
D3V0: 04-SNESDRONE_Direct_IO_LEVEL_SHIFTER_1 (U7.3), 06-SNESDRONE_Direct_IO_ARTY_Z7 (J3.0)
D3V1: 04-SNESDRONE_Direct_IO_LEVEL_SHIFTER_1 (U7.4), 06-SNESDRONE_Direct_IO_ARTY_Z7 (J3.1)
D3V2: 04-SNESDRONE_Direct_IO_LEVEL_SHIFTER_1 (U7.5), 06-SNESDRONE_Direct_IO_ARTY_Z7 (J3.2)
D3V3: 04-SNESDRONE_Direct_IO_LEVEL_SHIFTER_1 (U7.6), 06-SNESDRONE_Direct_IO_ARTY_Z7 (J3.3)
D3V4: 04-SNESDRONE_Direct_IO_LEVEL_SHIFTER_1 (U7.7), 06-SNESDRONE_Direct_IO_ARTY_Z7 (J3.11)
D3V5: 04-SNESDRONE_Direct_IO_LEVEL_SHIFTER_1 (U7.8), 06-SNESDRONE_Direct_IO_ARTY_Z7 (J3.10)
D3V6: 04-SNESDRONE_Direct_IO_LEVEL_SHIFTER_1 (U7.9), 06-SNESDRONE_Direct_IO_ARTY_Z7 (J3.9)
D3V7: 04-SNESDRONE_Direct_IO_LEVEL_SHIFTER_1 (U7.10), 06-SNESDRONE_Direct_IO_ARTY_Z7 (J3.8)
D5V0: 04-SNESDRONE_Direct_IO_LEVEL_SHIFTER_1 (U7.21), 07-SNESDRONE_Direct_IO_CART (J1.19)
D5V1: 04-SNESDRONE_Direct_IO_LEVEL_SHIFTER_1 (U7.20), 07-SNESDRONE_Direct_IO_CART (J1.20)
D5V2: 04-SNESDRONE_Direct_IO_LEVEL_SHIFTER_1 (U7.19), 07-SNESDRONE_Direct_IO_CART (J1.21)
D5V3: 04-SNESDRONE_Direct_IO_LEVEL_SHIFTER_1 (U7.18), 07-SNESDRONE_Direct_IO_CART (J1.22)
D5V4: 04-SNESDRONE_Direct_IO_LEVEL_SHIFTER_1 (U7.17), 07-SNESDRONE_Direct_IO_CART (J1.50)
D5V5: 04-SNESDRONE_Direct_IO_LEVEL_SHIFTER_1 (U7.16), 07-SNESDRONE_Direct_IO_CART (J1.51)
D5V6: 04-SNESDRONE_Direct_IO_LEVEL_SHIFTER_1 (U7.15), 07-SNESDRONE_Direct_IO_CART (J1.52)
D5V7: 04-SNESDRONE_Direct_IO_LEVEL_SHIFTER_1 (U7.14), 07-SNESDRONE_Direct_IO_CART (J1.53)
DATLVL_DIR: 04-SNESDRONE_Direct_IO_LEVEL_SHIFTER_1 (U7.2), 06-SNESDRONE_Direct_IO_ARTY_Z7 (J4.1)
SNES_3V3_#CART: 05-SNESDRONE_Direct_IO_LEVEL_SHIFTER_2 (U9.4), 06-SNESDRONE_Direct_IO_ARTY_Z7 (J2.52)
SNES_3V3_#IRQ: 05-SNESDRONE_Direct_IO_LEVEL_SHIFTER_2 (U8.3), 06-SNESDRONE_Direct_IO_ARTY_Z7 (J2.53)
SNES_3V3_#RD: 05-SNESDRONE_Direct_IO_LEVEL_SHIFTER_2 (U8.5), 06-SNESDRONE_Direct_IO_ARTY_Z7 (J2.51)
SNES_3V3_#RST: 05-SNESDRONE_Direct_IO_LEVEL_SHIFTER_2 (U8.7), 06-SNESDRONE_Direct_IO_ARTY_Z7 (J2.49)
SNES_3V3_#WR: 05-SNESDRONE_Direct_IO_LEVEL_SHIFTER_2 (U8.6), 06-SNESDRONE_Direct_IO_ARTY_Z7 (J2.50)
SNES_3V3_CPU_CLK: 05-SNESDRONE_Direct_IO_LEVEL_SHIFTER_2 (U9.8), 06-SNESDRONE_Direct_IO_ARTY_Z7 (J2.48)
SNES_#CART: 05-SNESDRONE_Direct_IO_LEVEL_SHIFTER_2 (U9.20), 07-SNESDRONE_Direct_IO_CART (J1.49)
SNES_#IRQ: 05-SNESDRONE_Direct_IO_LEVEL_SHIFTER_2 (U8.21), 07-SNESDRONE_Direct_IO_CART (J1.18)
SNES_#RD: 05-SNESDRONE_Direct_IO_LEVEL_SHIFTER_2 (U8.19), 07-SNESDRONE_Direct_IO_CART (J1.23)
SNES_#RST: 05-SNESDRONE_Direct_IO_LEVEL_SHIFTER_2 (U8.17), 07-SNESDRONE_Direct_IO_CART (J1.26)
SNES_#WR: 05-SNESDRONE_Direct_IO_LEVEL_SHIFTER_2 (U8.18), 07-SNESDRONE_Direct_IO_CART (J1.54)
SNES_CPU_CLK: 05-SNESDRONE_Direct_IO_LEVEL_SHIFTER_2 (U9.16), 07-SNESDRONE_Direct_IO_CART (J1.57)
SNESCTRLLVL_DIR: 05-SNESDRONE_Direct_IO_LEVEL_SHIFTER_2 (U8.2), 06-SNESDRONE_Direct_IO_ARTY_Z7 (J4.2)